# EAGLE schematic pretinhaMonitorBoard (EAGLE 9.3.0)
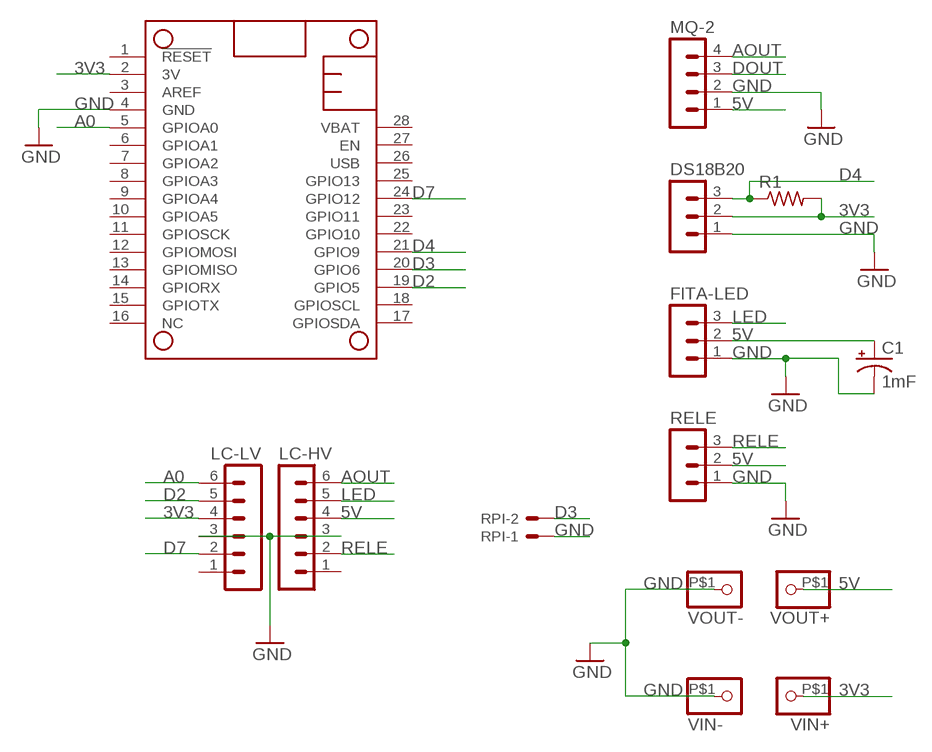
[diagram p0: schematic, sheet 1]

## Parts
C1  1mF  1000UF-RADIAL-5MM-25V-20%  [CPOL-RADIAL-5MM-10MM]
DS18B20  MA03-1  [MA03-1]
FITA-LED  MA03-1  [MA03-1]
LC-HV  MA06-1  [MA06-1]
LC-LV  MA06-1  [MA06-1]
MESH  FEATHERWING_NODIM  [FEATHERWING_DIM]
MQ-2  MA04-1  [MA04-1]
R1  R-US_0411/15  [0411/15]
RELE  MA03-1  [MA03-1]
RPI  22-23-2021  [22-23-2021]
VIN+  PINHD-1X1-BIGPOGO  [1X1-BIGPOGO]
VIN-  PINHD-1X1-BIGPOGO  [1X1-BIGPOGO]
VOUT+  PINHD-1X1-BIGPOGO  [1X1-BIGPOGO]
VOUT-  PINHD-1X1-BIGPOGO  [1X1-BIGPOGO]

## Nets
3V3: DS18B20.2 LC-LV.4 MESH.2(3V) R1.2 VIN+.P$1
5V: C1.+ FITA-LED.2 LC-HV.4 MQ-2.1 RELE.2 VOUT+.P$1
A0: LC-LV.6 MESH.5(GPIOA0)
AOUT: LC-HV.6 MQ-2.4
D2: LC-LV.5 MESH.19(GPIO5)
D3: MESH.20(GPIO6) RPI.2
D4: DS18B20.3 MESH.21(GPIO9) R1.1
D7: LC-LV.2 MESH.24(GPIO12)
DOUT: MQ-2.3
GND: C1.- DS18B20.1 FITA-LED.1 LC-HV.3 LC-LV.3 MESH.4(GND) MQ-2.2 RELE.1 RPI.1 VIN-.P$1 VOUT-.P$1
LED: FITA-LED.3 LC-HV.5
RELE: LC-HV.2 RELE.3
Unconnected: LC-HV.1 LC-LV.1 MESH.1(!RESET) MESH.3(AREF) MESH.6(GPIOA1) MESH.7(GPIOA2) MESH.8(GPIOA3) MESH.9(GPIOA4) MESH.10(GPIOA5) MESH.11(GPIOSCK) MESH.12(GPIOMOSI) MESH.13(GPIOMISO) MESH.14(GPIORX) MESH.15(GPIOTX) MESH.16(NC) MESH.17(GPIOSDA) MESH.18(GPIOSCL) MESH.22(GPIO10) MESH.23(GPIO11) MESH.25(GPIO13) MESH.26(USB) MESH.27(EN) MESH.28(VBAT)

## Library data of the parts
C1 = SparkFun-Capacitors:1000UF: 1,000µF/1mF ceramic capacitors A capacitor is a passive two-terminal electrical component used to store electrical energy temporarily in an electric field. CAP-08070; PROD_ID: CAP-09538
DS18B20 FITA-LED RELE = con-lstb:MA03-1: PIN HEADER; OC_FARNELL: unknown; OC_NEWARK: unknown
LC-HV LC-LV = con-lstb:MA06-1: PIN HEADER; OC_FARNELL: unknown; OC_NEWARK: unknown
MESH = adafruit:FEATHERWING
MQ-2 = con-lstb:MA04-1: PIN HEADER; OC_FARNELL: unknown; OC_NEWARK: unknown
R1 = resistor:R-US_: RESISTOR, American symbol
RPI = con-molex:22-23-2021: .100" (2.54mm) Center Header - 2 Pin; MF: MOLEX; MPN: 22-23-2021; OC_FARNELL: 1462926; OC_NEWARK: 25C3832
VIN+ VIN- VOUT+ VOUT- = adafruit:PINHD-1X1: Pin header 1x1 for 0.1" spacing With round pins

## Net classes
0 default: width 0.6 mm, drill 1 mm, clearance 0.2 mm